# Altium schematic sheet Hbridge.SchDoc
size A4
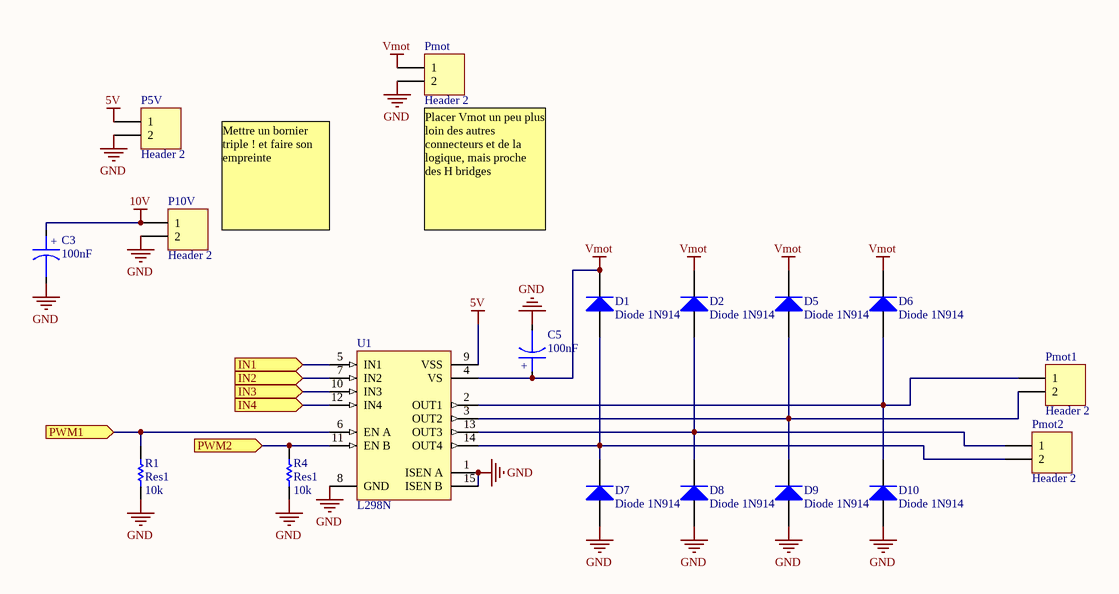
[diagram p0: Hbridge.SchDoc]

## Parts
C3  value 100nF  [RB.1/.3]  (hidden comment: CAP Pol)
C5  value 100nF  [RB.2/.4]  (hidden comment: CAP Pol)
D1  Diode 1N914  [DO-35]
D2  Diode 1N914  [DO-35]
D5  Diode 1N914  [DO-35]
D6  Diode 1N914  [DO-35]
D7  Diode 1N914  [DO-35]
D8  Diode 1N914  [DO-35]
D9  Diode 1N914  [DO-35]
D10  Diode 1N914  [DO-35]
P5V  Header 2  [Bornier male coude 2 voies]
P10V  Header 2  [Bornier male coude 2 voies]
Pmot  Header 2  [Bornier male coude 2 voies]
Pmot1  Header 2  [TERM2W-3.5]
Pmot2  Header 2  [TERM2W-3.5]
R1  Res1  value 10k  [AXIAL-0.3]
R4  Res1  value 10k  [AXIAL-0.3]
U1  L298N  [Multiwatt15V]

## Ports
IN1 (in), IN2 (in), IN3 (in), IN4 (in), PWM1 (in), PWM2 (in)

## Nets
5V: P5V.1 U1.9(VSS)
10V: C3.1 P10V.1
GND: C3.2 C5.2 D7.1(A) D8.1(A) D9.1(A) D10.1(A) P5V.2 P10V.2 Pmot.2 R1.1 R4.1 U1.1(ISEN_A) U1.8(GND) U1.15(ISEN_B)
Vmot: C5.1 D1.2(K) D2.2(K) D5.2(K) D6.2(K) Pmot.1 U1.4(VS)
IN1: U1.5(IN1) ; port IN1
IN2: U1.7(IN2) ; port IN2
IN3: U1.10(IN3) ; port IN3
IN4: U1.12(IN4) ; port IN4
PWM1: R1.2 U1.6(EN_A) ; port PWM1
PWM2: R4.2 U1.11(EN_B) ; port PWM2
NetD1_1: D1.1(A) D7.2(K) Pmot2.2 U1.14(OUT4)
NetD2_1: D2.1(A) D8.2(K) Pmot2.1 U1.13(OUT3)
NetD5_1: D5.1(A) D9.2(K) Pmot1.2 U1.3(OUT2)
NetD6_1: D6.1(A) D10.2(K) Pmot1.1 U1.2(OUT1)

## Notes on the sheet
- Mettre un bornier triple ! et faire son empreinte
- (near Pmot) Placer Vmot un peu plus loin des autres connecteurs et de la logique, mais proche des H bridges
- (in symbol CAP Pol) +

## Library data of the parts
C3 C5 = CAP Pol: Polarized Capacitor
D1 D2 D5-D10 = Diode 1N914: High Conductance Fast Diode; Published: 8-Jun-2000; LatestRevisionDate: 17-Jul-2002; LatestRevisionNote: Re-released for DXP Platform.; DatasheetVersion: 1997; PackageReference: DO-35; Publisher: Altium Limited; PackageDescription: Diode, Axial; Body 3.8 x 1.9 mm (LxDia. max), Lead Dia. 0.53 mm (max); Code_JEDEC: DO-204-AH; ComponentLink1Description: Manufacturer Link; ComponentLink1URL: http://www.fairchildsemi.com/; ComponentLink2Description: Datasheet; ComponentLink2URL: http://www.fairchildsemi.com/ds/1N%2F1N4448.pdf
P5V P10V Pmot Pmot1 Pmot2 = Header 2: Header, 2-Pin; LatestRevisionDate: 17-Jul-2002; LatestRevisionNote: Re-released for DXP Platform.; Publisher: Altium Limited
R1 R4 = Res1: Resistor; Published: 8-Jun-2000; LatestRevisionDate: 17-Jul-2002; LatestRevisionNote: Re-released for DXP Platform.; PackageReference: AXIAL-0.3; Publisher: Altium Limited; PackageDescription: Axial Device, Thru-Hole; 2 Leads; 0.3 in Pin Spacing
U1 = L298N: Dual Full Bridge Driver; Published: 8-Jun-2000; LatestRevisionDate: 14-May-2007; LatestRevisionNote: Mapped to vertical PCB.; DatasheetVersion: Jul-1999; PackageReference: Multiwatt15V; Publisher: Altium Limited; PackageDescription: TO, Thru-Hole, Vertical, Heatsink Mounted; 15 Bent Staggered Leads; Pitch 1.27 mm; ComponentLink1Description: Manufacturer Link; ComponentLink1URL: http://www.st.com/; ComponentLink2Description: Datasheet; ComponentLink2URL: http://www.st.com/stonline/products/literature/ds/1773/l298.pdf